# Altium schematic sheet Sensors.SchDoc
size A4; SheetNumber: 4; SheetTotal: 6
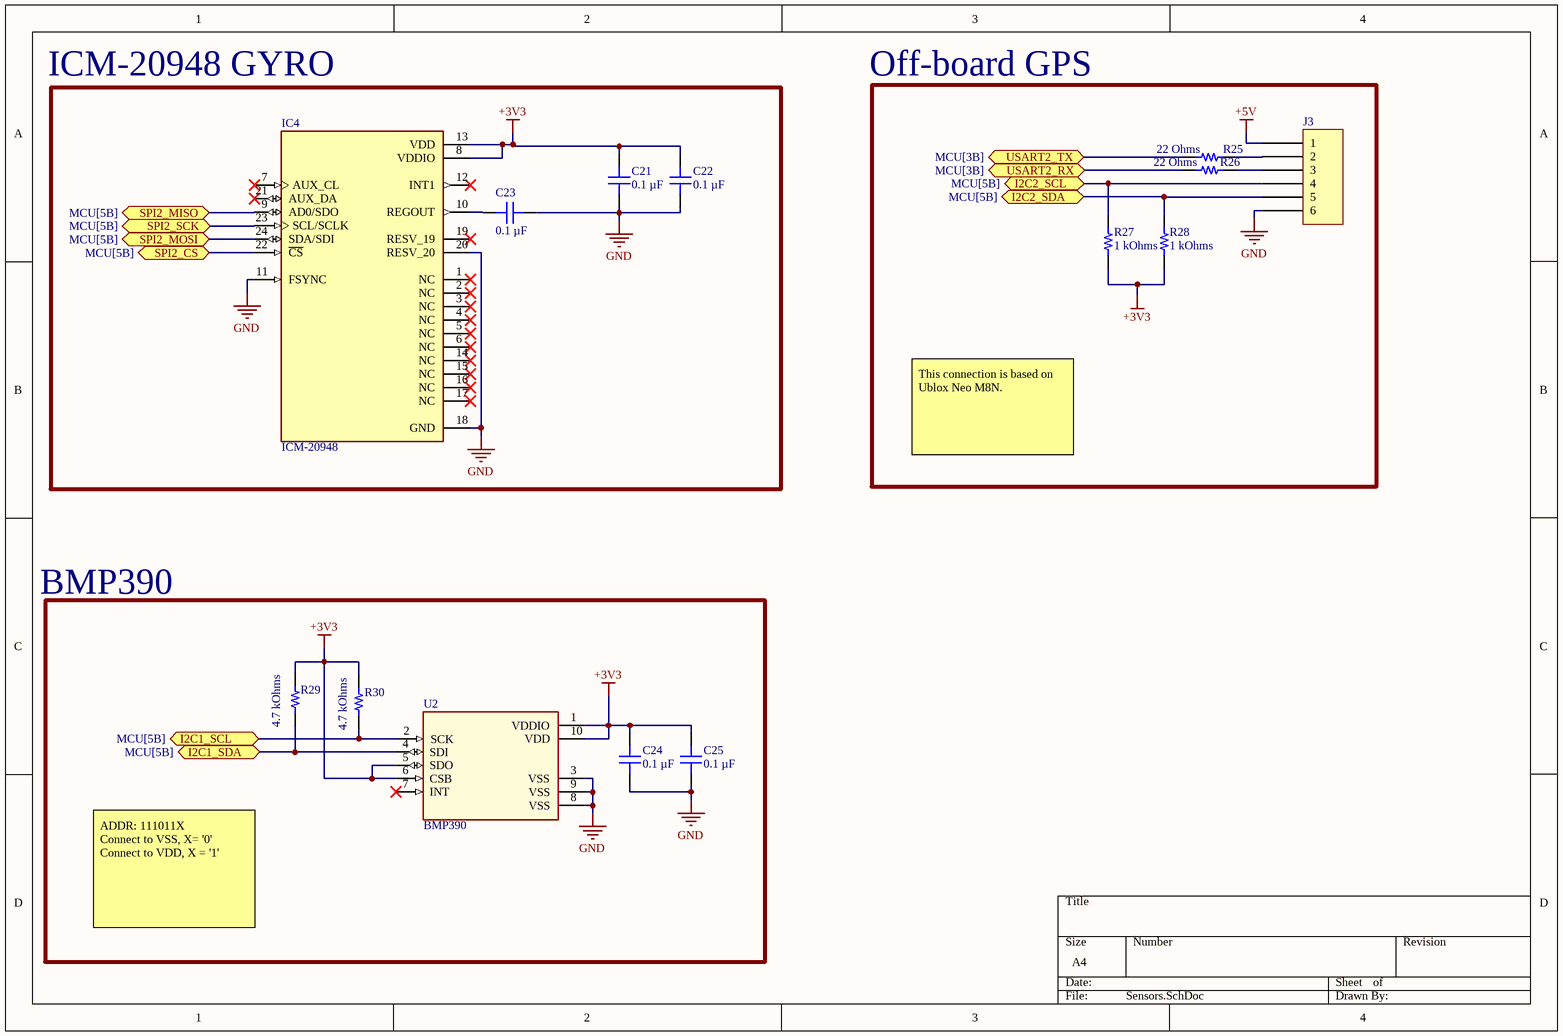
[diagram p0: Sensors.SchDoc]

## Parts
C21  0.1 µF  [CAP 0603_1608]
C22  0.1 µF  [CAP 0603_1608]
C23  0.1 µF  [CAP 0603_1608]
C24  0.1 µF  [CAP 0603_1608]
C25  0.1 µF  [CAP 0603_1608]
IC4  ICM-20948  [ICM-20948]
J3  SM06B-SRSS-TB(LF)(SN)  [JST SM06B-SRSS-TB]  (value not drawn)
R25  22 Ohms  [YAGEO RES 0402_1005]
R26  22 Ohms  [YAGEO RES 0402_1005]
R27  1 kOhms  [YAGEO RES 0402_1005]
R28  1 kOhms  [YAGEO RES 0402_1005]
R29  4.7 kOhms  [YAGEO RES 0402_1005]
R30  4.7 kOhms  [YAGEO RES 0402_1005]
U2  BMP390  [BMP390]

## Blocks framed on the sheet
Off-board GPS: J3 R25-R28
ICM-20948 GYRO: C21-C23 IC4

## Ports
I2C1_SCL (bidir, see MCU[5B]), I2C1_SDA (bidir, see MCU[5B]), I2C2_SCL (bidir, see MCU[5B]), I2C2_SDA (bidir, see MCU[5B]), SPI2_CS (bidir, see MCU[5B]), SPI2_MISO (bidir, see MCU[5B]), SPI2_MOSI (bidir, see MCU[5B]), SPI2_SCK (bidir, see MCU[5B]), USART2_RX (bidir, see MCU[3B]), USART2_TX (bidir, see MCU[3B])

## Nets
+3V3: C21.2 C22.2 C24.2 C25.2 IC4.8(VDDIO) IC4.13(VDD) R27.1 R28.1 R29.2 R30.2 U2.1(VDDIO) U2.5(SDO) U2.6(CSB) U2.10(VDD)
+5V: J3.1
GND: C21.1 C22.1 C23.1 C24.1 C25.1 IC4.11(FSYNC) IC4.18(GND) IC4.20(RESV_20) J3.6 U2.3(VSS) U2.8(VSS) U2.9(VSS)
I2C1_SCL: R30.1 U2.2(SCK) ; port I2C1_SCL
I2C1_SDA: R29.1 U2.4(SDI) ; port I2C1_SDA
I2C2_SCL: J3.4 R27.2 ; port I2C2_SCL
I2C2_SDA: J3.5 R28.2 ; port I2C2_SDA
SPI2_CS: IC4.22(~{CS}) ; port SPI2_CS
SPI2_MISO: IC4.9(AD0/SDO) ; port SPI2_MISO
SPI2_MOSI: IC4.24(SDA/SDI) ; port SPI2_MOSI
SPI2_SCK: IC4.23(SCL/SCLK) ; port SPI2_SCK
USART2_RX: R26.1 ; port USART2_RX
USART2_TX: R25.1 ; port USART2_TX
NetC23_2: C23.2 IC4.10(REGOUT)
NetJ3_2: J3.2 R25.2
NetJ3_3: J3.3 R26.2

Not connected (* = marked no-connect by the designer): IC4 1(NC)* 2(NC)* 3(NC)* 4(NC)* 5(NC)* 6(NC)* 7(AUX_CL)* 12(INT1)* 14(NC)* 15(NC)* 16(NC)* 17(NC)* 19(RESV_19)* 21(AUX_DA)*; U2 7(INT)*

## Notes on the sheet
- This connection is based on Ublox Neo M8N.
- BMP390
- ADDR: 111011X
  Connect to VSS, X= '0'
  Connect to VDD, X = '1'

## Library data of the parts
C21-C25 = GCJ188R71C104KA01D: CAP CER 0.1UF 16V X7R 0603; manufacturer: Murata Electronics; Tolerance: ±10%; Part Number: GCJ188R71C104KA01D; Capacitance: 0.1 µF; Applications: Automotive, Boardflex Sensitive; componentlink1description: Datasheet; componentlink1url: https://www.murata.com/~/media/webrenewal/support/library/catalog/products/capacitor/mlcc/c03e.ashx?la=en-us; componentlink2description: DigiKey Link; componentlink2url: https://www.digikey.com/en/products/detail/murata-electronics/GCJ188R71C104KA01D/2783813; Device Package: 0603 (1608 Metric); Features: Soft Termination; lastupdated: 9.02.2024 20:10:06; Lifecycle Status: Active; Minimum Order: 1; Mounting Type: Surface Mount, MLCC; Operating Temperature: -55°C ~ 125°C; Package / Case: 0603 (1608 Metric); packaging: TapeAndReel; partid: 17928; Part Status: Active; price: 0.02; Ratings: AEC-Q200; series: GCJ; Size / Dimension: 0.063" L x 0.031" W (1.60mm x 0.80mm); Supplier 1: DigiKey; Supplier Part Number 1: 490-5796-1-ND; Temperature Coefficient: X7R; Thickness (Max): 0.035" (0.90mm); value: 0.1 µF; Voltage - Rated: 16V
IC4 = ICM-20948: Accelerometer, Gyroscope, Magnetometer, 9 Axis Sensor I2C, SPI Output; Parameter 4: Package / Case; Sensor Type: Accelerometer, Gyroscope, Magnetometer, 9 Axis; Output Type: I2C, SPI; Operating Temperature: -40°C ~ 85°C
J3 = SM06B-SRSS-TB(LF)(SN): CONN HEADER SMD R/A 6POS 1MM; Manufacturer: JST Sales America Inc.; Current Rating (Amps): 0.7A; Material Flammability Rating: UL94 V-0; Number of Positions: 6; Number of Positions Loaded: All; Pitch - Mating: 0.039" (1.00mm); Shrouding: Shrouded - 4 Wall; Style: Board to Cable/Wire; Voltage Rating: 50V; Part Number: SM06B-SRSS-TB(LF)(SN); ComponentLink1Description: Datasheet; ComponentLink1URL: http://www.jst-mfg.com/product/pdf/eng/eSH.pdf; ComponentLink2Description: DigiKey Link; ComponentLink2URL: http://digikey.com/product-detail/en/jst-sales-america-inc/SM06B-SRSS-TB-LF-SN/455-1806-1-ND/926877; Connector Type: Header; Contact Finish - Mating: Tin; Contact Finish - Post: Tin; Contact Material: Copper Alloy; Contact Shape: Square; Contact Type: Male Pin; Fastening Type: Push-Pull; Features: Solder Retention; Insulation Color: Natural; Insulation Height: 0.114" (2.90mm); Insulation Material: Polyamide (PA), Nylon; LastUpdated: 12.01.2020 23:42:14; Lifecycle Status: Active; Minimum Order: 1; Mounting Type: Surface Mount, Right Angle; Number of Rows: 1; Operating Temperature: -25°C ~ 85°C; Packaging: TapeAndReel; PartId: 64; Part Status: Active; Price: 0.36; Series: SR; Supplier 1: DigiKey; Supplier Part Number 1: 455-1806-1-ND; Termination: Solder
R25 R26 = AC0402JR-0722RL: RES SMD 22 OHM 5% 1/16W 0402; Manufacturer: Yageo; Power (Watts): 0.063W, 1/16W; Temperature Coefficient: ±100ppm/°C; Part Number: AC0402JR-0722RL; Value: 22 Ohms; ComponentLink1Description: Datasheet; ComponentLink1URL: https://www.yageo.com/upload/media/product/productsearch/datasheet/rchip/PYu-AC_51_RoHS_L_7.pdf; ComponentLink2Description: DigiKey Link; ComponentLink2URL: https://www.digikey.com/en/products/detail/yageo/AC0402JR-0722RL/5895625; Composition: Thick Film; Device Package: 0402 (1005 Metric); Features: Automotive AEC-Q200, Moisture Resistant; Height - Seated (Max): 0.015" (0.37mm); LastUpdated: 25.07.2024 09:18:12; Lifecycle Status: Active; Minimum Order: 1; Number of Terminations: 2; Operating Temperature: -55°C ~ 155°C; Package / Case: 0402 (1005 Metric); Packaging: CutTape; PartId: 15641; Part Status: Active; Price: 0.01; Ratings: AEC-Q200; Resistance: 22 Ohms; Series: AC; Size / Dimension: 0.039" L x 0.020" W (1.00mm x 0.50mm); Supplier 1: DigiKey; Supplier Part Number 1: YAG3533CT-ND; Supplier Device Package: 0402; Tolerance: ±5%
R27 R28 = AC0402JR-071KL: RES SMD 1K OHM 5% 1/16W 0402; Manufacturer: Yageo; Power (Watts): 0.063W, 1/16W; Temperature Coefficient: ±100ppm/°C; Part Number: AC0402JR-071KL; Value: 1 kOhms; ComponentLink1Description: Datasheet; ComponentLink1URL: https://www.yageo.com/upload/media/product/productsearch/datasheet/rchip/PYu-AC_51_RoHS_L_7.pdf; ComponentLink2Description: DigiKey Link; ComponentLink2URL: https://www.digikey.com/en/products/detail/yageo/AC0402JR-071KL/5895603; Composition: Thick Film; Device Package: 0402 (1005 Metric); Features: Automotive AEC-Q200, Moisture Resistant; Height - Seated (Max): 0.015" (0.37mm); LastUpdated: 25.07.2024 09:18:18; Lifecycle Status: Active; Minimum Order: 1; Number of Terminations: 2; Operating Temperature: -55°C ~ 155°C; Package / Case: 0402 (1005 Metric); Packaging: CutTape; PartId: 3403; Part Status: Active; Price: 0.01; Ratings: AEC-Q200; Resistance: 1 kOhms; Series: AC; Size / Dimension: 0.039" L x 0.020" W (1.00mm x 0.50mm); Supplier 1: DigiKey; Supplier Part Number 1: YAG3525CT-ND; Supplier Device Package: 0402; Tolerance: ±5%
R29 R30 = RT0402FRE074K7L: RES SMD 4.7K OHM 1% 1/16W 0402; Manufacturer: Yageo; Power (Watts): 0.063W, 1/16W; Temperature Coefficient: ±50ppm/°C; Part Number: RT0402FRE074K7L; Value: 4.7 kOhms; ComponentLink1Description: Datasheet; ComponentLink1URL: https://www.yageo.com/upload/media/product/productsearch/datasheet/rchip/PYu-RT_1-to-0.01_RoHS_L_11.pdf; ComponentLink2Description: DigiKey Link; ComponentLink2URL: https://www.digikey.com/en/products/detail/yageo/RT0402FRE074K7L/1072052; Composition: Thin Film; Device Package: 0402 (1005 Metric); Height - Seated (Max): 0.014" (0.35mm); LastUpdated: 25.07.2024 09:18:18; Lifecycle Status: Active; Minimum Order: 1; Number of Terminations: 2; Operating Temperature: -55°C ~ 155°C; Package / Case: 0402 (1005 Metric); Packaging: TapeAndReel; PartId: 3198; Part Status: Active; Price: 0.01; Resistance: 4.7 kOhms; Series: RT; Size / Dimension: 0.039" L x 0.020" W (1.00mm x 0.50mm); Supplier 1: DigiKey; Supplier Part Number 1: YAG3347CT-ND; Supplier Device Package: 0402; Tolerance: ±1%
U2 = BMP390: Pressure Sensor 4.35PSI ~ 18.13PSI (30kPa ~ 125kPa) Absolute 10-WFLGA; Manufacturer: Bosch Sensortech; Output Type: I2C, SPI; Accuracy: ±0.01PSI (0.05kPa); Voltage Supply: 1.65V ~ 3.6V; Maximum Pressure: 290.08PSI (2000kPa); Operating Pressure: 4.35PSI ~ 18.13PSI (30kPa ~ 125kPa); Operating Temperature: -40°C ~ 85°C (TA); Package / Case: 10-WFLGA; ComponentLink1Description: Datasheet; ComponentLink1URL: https://www.bosch-sensortec.com/media/boschsensortec/downloads/datasheets/bst-bmp390-ds002.pdf; ComponentLink2Description: Digikey Link; ComponentLink2URL: https://www.digikey.com/en/products/detail/bosch-sensortec/bmp390/16164575